# Altium schematic sheet bmsMaster_isospi.SchDoc
size A; SheetNumber: 5; SheetTotal: 7
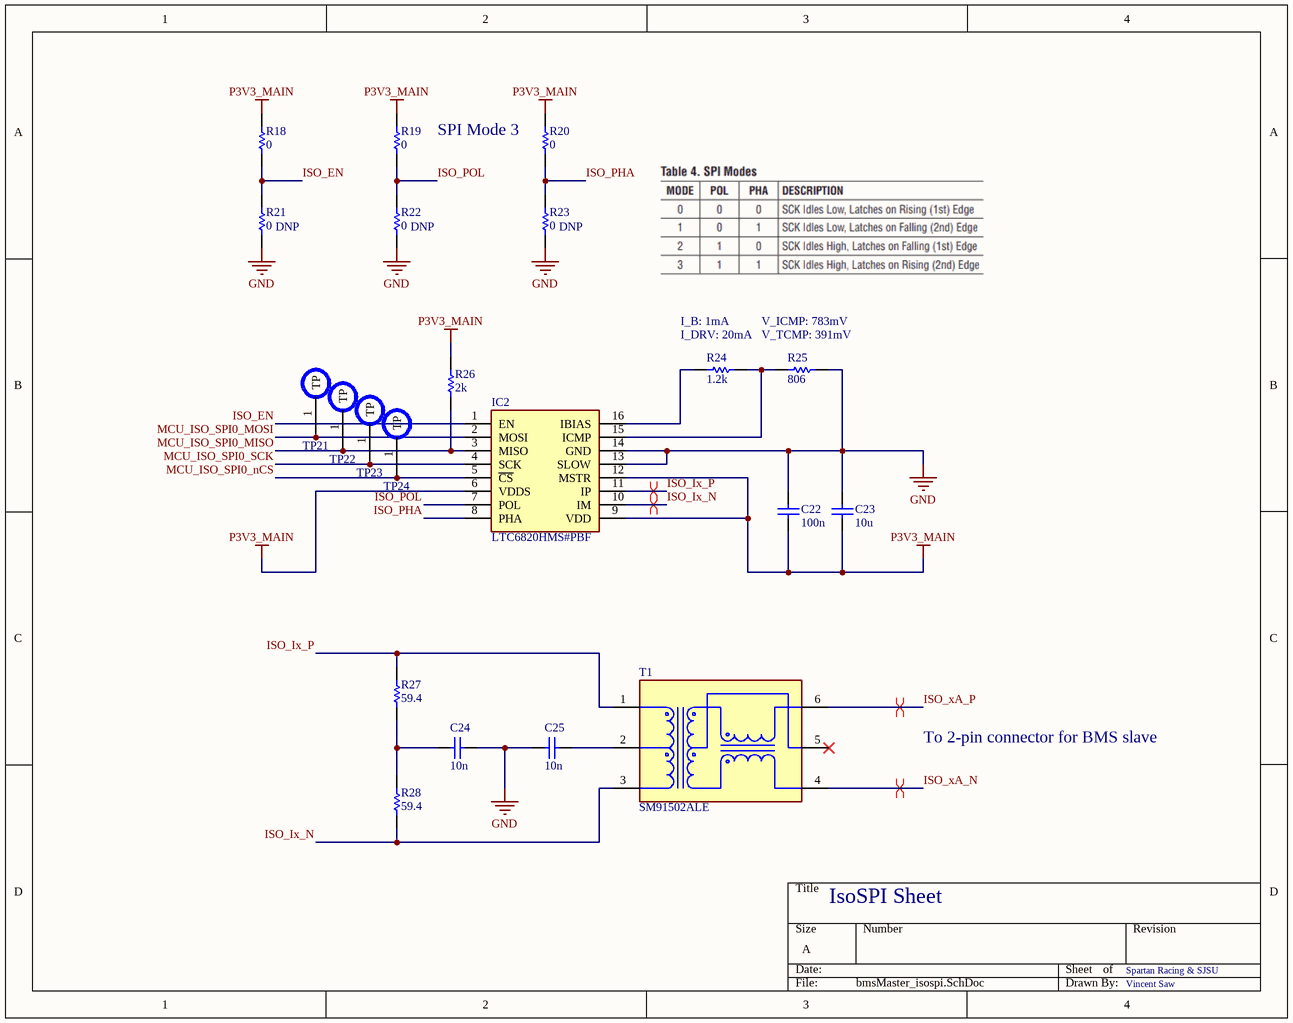
[diagram p0: bmsMaster_isospi.SchDoc]

## Parts
C22  value 100n  [CAPC1608X90N]  (hidden comment: Capacitor)
C23  value 10u  [CAPC1608X90N]  (hidden comment: Capacitor)
C24  value 10n  [CAPC1608X90N]  (hidden comment: Capacitor)
C25  value 10n  [CAPC1608X90N]  (hidden comment: Capacitor)
IC2  LTC6820HMS#PBF  [SOP50P490X110-16N]
R18  value 0  [RESC1608X50N]  (hidden comment: Resistor)
R19  value 0  [RESC1608X50N]  (hidden comment: Resistor)
R20  value 0  [RESC1608X50N]  (hidden comment: Resistor)
R21  value 0  [RESC1608X50N]  (hidden comment: Resistor)
R22  value 0  [RESC1608X50N]  (hidden comment: Resistor)
R23  value 0  [RESC1608X50N]  (hidden comment: Resistor)
R24  value 1.2k  [RESC1608X50N]  (hidden comment: Resistor)
R25  value 806  [RESC1608X50N]  (hidden comment: Resistor)
R26  value 2k  [RESC1608X50N]  (hidden comment: Resistor)
R27  value 59.4  [RESC1608X50N]  (hidden comment: Resistor)
R28  value 59.4  [RESC1608X50N]  (hidden comment: Resistor)
T1  SM91502ALE  [FP-SM91502ALE-MFG]
TP21  TSTPT  [Testpoint1]  (value not drawn)  (no BOM)
TP22  TSTPT  [Testpoint1]  (value not drawn)  (no BOM)
TP23  TSTPT  [Testpoint1]  (value not drawn)  (no BOM)
TP24  TSTPT  [Testpoint1]  (value not drawn)  (no BOM)

## Nets
GND: C22.2 C23.2 C24.1 C25.1 IC2.13(SLOW) IC2.14(GND) R21.1 R22.1 R23.1 R25.2
P3V3_MAIN: C22.1 C23.1 IC2.6(VDDS) IC2.9(VDD) IC2.12(MSTR) R18.2 R19.2 R20.2 R26.2
ISO_EN: IC2.1(EN) R18.1 R21.2
ISO_Ix_N: IC2.10(IM) R28.1 T1.3
ISO_Ix_P: IC2.11(IP) R27.2 T1.1
ISO_PHA: IC2.8(PHA) R20.1 R23.2
ISO_POL: IC2.7(POL) R19.1 R22.2
ISO_xA_N: T1.4
ISO_xA_P: T1.6
MCU_ISO_SPI0_MISO: IC2.3(MISO) R26.1 TP22.1(TP)
MCU_ISO_SPI0_MOSI: IC2.2(MOSI) TP21.1(TP)
MCU_ISO_SPI0_nCS: IC2.5(~{CS}) TP24.1(TP)
MCU_ISO_SPI0_SCK: IC2.4(SCK) TP23.1(TP)
NetC24_2: C24.2 R27.1 R28.2
NetC25_2: C25.2 T1.2
NetIC2_15: IC2.15(ICMP) R24.2 R25.1
NetIC2_16: IC2.16(IBIAS) R24.1

Not connected (* = marked no-connect by the designer): T1 5*

## Layout directives
differential pair: ISO_Ix_N, ISO_Ix_P, ISO_xA_N, ISO_xA_P

## Notes on the sheet
- (near R20) SPI Mode 3
- (near R21) DNP
- (near R22) DNP
- (near R23) DNP
- (near R24) I_B: 1mA
- (near R24) I_DRV: 20mA
- V_ICMP: 783mV
- V_TCMP: 391mV
- To 2-pin connector for BMS slave
- IsoSPI Sheet
- Spartan Racing & SJSU
- Vincent Saw

## Library data of the parts
C22-C25 = Capacitor: SimulationGenericComponent: True
IC2 = LTC6820HMS#PBF: Integrated Circuit; Manufacturer_Name: Analog Devices; Datasheet Link: https://www.analog.com/media/en/technical-documentation/data-sheets/LTC6820.pdf; Height: 1.1mm; Manufacturer_Part_Number: LTC6820HMS#PBF; Mouser Part Number: 584-LTC6820HMS#PBF; Mouser Price/Stock: https://www.mouser.co.uk/ProductDetail/Analog-Devices/LTC6820HMSPBF?qs=hVkxg5c3xu%252BAhS55eUb%252BEQ%3D%3D; Arrow Part Number: LTC6820HMS#PBF; Arrow Price/Stock: https://www.arrow.com/en/products/ltc6820hmspbf/analog-devices?region=europe
R18-R23 = Resistor: SimulationGenericComponent: True; TC1: 0; TC2: 0
R24-R28 = Resistor: TC1: 0; SimulationGenericComponent: True; TC2: 0
T1 = CMP-07264-000001-1: BMS XFORMER 1-CH 1000V AECQ +125; Manufacturer: Bourns; Standoff Height: 0.13mm; Turns Ratio: 1:1; Automotive Grade: Grade 1; Isolation Voltage: 4300VDC; Return Loss: -22dB; Insertion Loss: -0.25dB; Height: 5.72mm; Automotive: Yes; Package: 0; Device Class L3: unset; ComponentLink2Description: Datasheet; Category: Trans; ComponentLink2URL: https://www.bourns.com/docs/product-datasheets/SM91502AL.pdf; Device Class L1: Passive Components; Manufacturer Part Number: SM91502ALE; Temperature Range High: +125°C; Digikey Description: BMS XFORMER 1-CH 1000V AECQ +125; RoHS: TRUE; Lead Free: Yes; Octopart: https://octopart.com/sm91502ale-bourns-95732123; Device Class L2: Transformers; Temperature: -40°C to +125°C; Temperature Range Low: -40°C
TP21-TP24 = Testpoint1